# EAGLE schematic con connector (EAGLE 9.0.1)
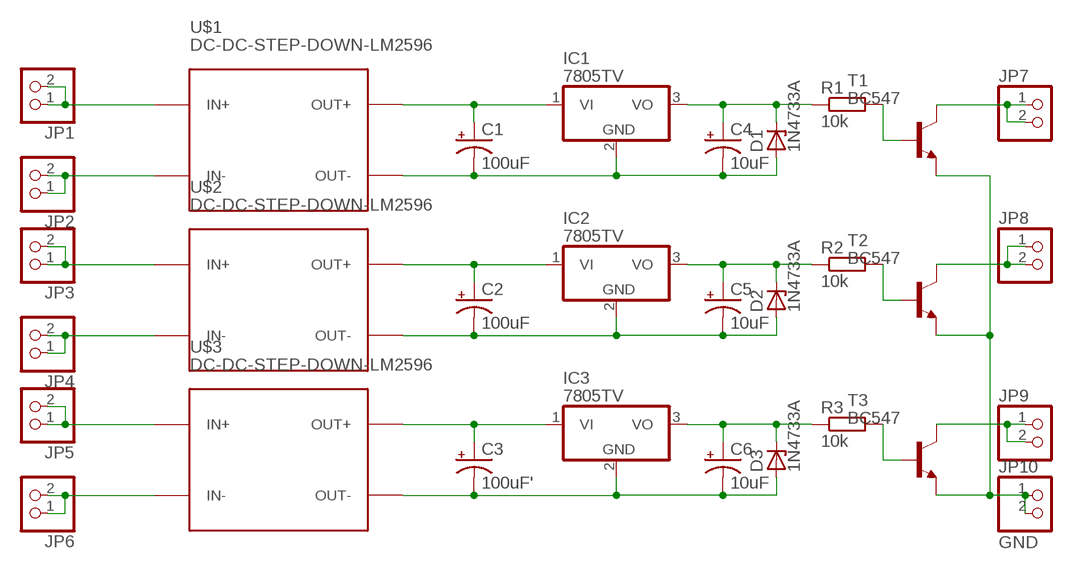
[diagram p0: schematic, sheet 1]

## Parts
C1  100uF  CPOL-USE2.5-7  [E2,5-7]
C2  100uF  CPOL-USE2.5-7  [E2,5-7]
C3  100uF'  CPOL-USE2.5-7  [E2,5-7]
C4  10uF  CPOL-USE2.5-6  [E2,5-6]
C5  10uF  CPOL-USE2.5-6  [E2,5-6]
C6  10uF  CPOL-USE2.5-6  [E2,5-6]
D1  1N4733A  1N4728  [DO41Z10]
D2  1N4733A  1N4728  [DO41Z10]
D3  1N4733A  1N4728  [DO41Z10]
IC1  7805TV  [TO220V]
IC2  7805TV  [TO220V]
IC3  7805TV  [TO220V]
JP1  PINHD-1X2  [1X02]
JP2  PINHD-1X2  [1X02]
JP3  PINHD-1X2  [1X02]
JP4  PINHD-1X2  [1X02]
JP5  PINHD-1X2  [1X02]
JP6  PINHD-1X2  [1X02]
JP7  PINHD-1X2  [1X02]
JP8  PINHD-1X2  [1X02]
JP9  PINHD-1X2  [1X02]
JP10  GND  PINHD-1X2  [1X02]
R1  10k  R-EU_0207/12  [0207/12]
R2  10k  R-EU_0207/12  [0207/12]
R3  10k  R-EU_0207/12  [0207/12]
T1  BC547  [TO92]
T2  BC547  [TO92]
T3  BC547  [TO92]
U$1  DC-DC-STEP-DOWN-LM2596  [DC-DC-STEP-DOWN-LM2596]
U$2  DC-DC-STEP-DOWN-LM2596  [DC-DC-STEP-DOWN-LM2596]
U$3  DC-DC-STEP-DOWN-LM2596  [DC-DC-STEP-DOWN-LM2596]

## Nets
N$1: C1.+ IC1.1(VI) U$1.OUT+
N$2: C1.- C4.- D1.A IC1.2(GND) U$1.OUT-
N$3: C2.+ IC2.1(VI) U$2.OUT+
N$4: C2.- C5.- D2.A IC2.2(GND) U$2.OUT-
N$5: C3.+ IC3.1(VI) U$3.OUT+
N$6: C3.- C6.- D3.A IC3.2(GND) U$3.OUT-
N$7: C4.+ D1.C IC1.3(VO) R1.1
N$8: C5.+ D2.C IC2.3(VO) R2.1
N$9: C6.+ D3.C IC3.3(VO) R3.1
N$15: R1.2 T1.2(B)
N$16: R2.2 T2.2(B)
N$17: R3.2 T3.2(B)
N$18: JP10.1 JP10.2 T1.1(E) T2.1(E) T3.1(E)
N$19: JP1.1 JP1.2 U$1.IN+
N$21: JP2.1 JP2.2 U$1.IN-
N$22: JP3.1 JP3.2 U$2.IN+
N$23: JP4.1 JP4.2 U$2.IN-
N$24: JP5.1 JP5.2 U$3.IN+
N$25: JP6.1 JP6.2 U$3.IN-
N$26: JP7.1 JP7.2 T1.3(C)
N$27: JP8.1 JP8.2 T2.3(C)
N$28: JP9.1 JP9.2 T3.3(C)

## Library data of the parts
C1-C6 = rcl:CPOL-US: POLARIZED CAPACITOR, American symbol; SPICEPREFIX: C
D1-D3 = diode:1N4728: Z DIODE 3.3 V, 1W, 5 percent
IC1-IC3 = linear:78*: Positive VOLTAGE REGULATOR Source: http://cache.national.com/ds/LM/LM78L05.pdf http://www.fairchildsemi.com/ds/LM/LM7805.pdf
JP1-JP10 = pinhead:PINHD-1X2: PIN HEADER
R1-R3 = rcl:R-EU_: RESISTOR, European symbol; SPICEPREFIX: R
T1-T3 = transistor:BC547: NPN TRANSISTOR
U$1-U$3 = diy-modules:DC-DC-STEP-DOWN-LM2596: DC/DC Step-Down Regulator based on LM2596-ADJ chip LM2596 datasheet available here: http://www.ti.com/lit/ds/symlink/lm2596.pdf Click here to find device on ebay.com <http://www.ebay.com/sch/lm2596+power+regulator>